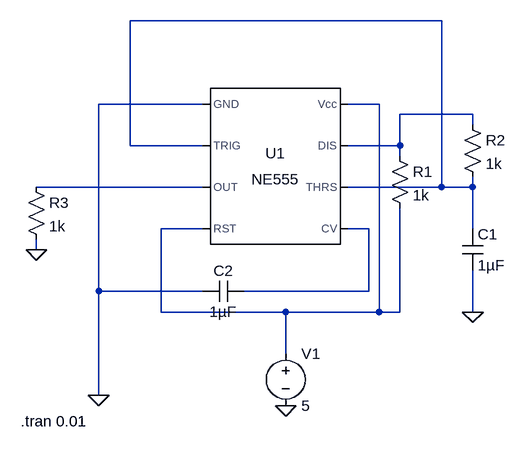
[diagram p0: schematic Draft1.asc]
Draft1.asc, the LTspice schematic file:
Version 4
SHEET 1 880 680
WIRE 320 -112 -160 -112
WIRE -48 16 -208 16
WIRE 224 16 176 16
WIRE 368 32 256 32
WIRE 368 48 368 32
WIRE -160 80 -160 -112
WIRE -48 80 -160 80
WIRE 256 80 256 32
WIRE 256 80 176 80
WIRE 256 96 256 80
WIRE -48 144 -304 144
WIRE 320 144 320 -112
WIRE 320 144 176 144
WIRE 368 144 368 128
WIRE 368 144 320 144
WIRE -48 208 -112 208
WIRE 208 208 176 208
WIRE 368 208 368 144
WIRE -304 240 -304 224
WIRE -208 304 -208 16
WIRE -48 304 -208 304
WIRE 208 304 208 208
WIRE 208 304 16 304
WIRE -112 336 -112 208
WIRE 80 336 -112 336
WIRE 224 336 224 16
WIRE 224 336 80 336
WIRE 256 336 256 176
WIRE 256 336 224 336
WIRE 368 336 368 272
WIRE 80 400 80 336
WIRE -208 464 -208 304
FLAG 368 336 0
FLAG 80 480 0
FLAG -208 464 0
FLAG -304 240 0
SYMBOL Misc\\NE555 64 112 R0
SYMATTR InstName U1
SYMBOL voltage 80 384 R0
WINDOW 123 0 0 Left 0
WINDOW 39 0 0 Left 0
SYMATTR InstName V1
SYMATTR Value 5
SYMBOL res 240 80 R0
SYMATTR InstName R1
SYMATTR Value 1k
SYMBOL res 352 32 R0
SYMATTR InstName R2
SYMATTR Value 1k
SYMBOL cap 352 208 R0
SYMATTR InstName C1
SYMATTR Value 1µF
SYMBOL cap 16 288 R90
WINDOW 0 0 32 VBottom 2
WINDOW 3 32 32 VTop 2
SYMATTR InstName C2
SYMATTR Value 1µF
SYMBOL res -320 128 R0
SYMATTR InstName R3
SYMATTR Value 1k
TEXT -328 504 Left 2 !.tran 0.01

The netlist it stands for:
* Draft1.asc
XU1 0 N001 N004 N002 N005 N001 N003 N002 NE555  ; pins GND TRIG OUT RST CV THRS DIS Vcc
V1 N002 0 5
R1 N003 N002 1k
R2 N003 N001 1k
C1 N001 0 1µF
C2 N005 0 1µF
R3 N004 0 1k
.tran 0.01
.lib NE555.sub
.backanno
.end